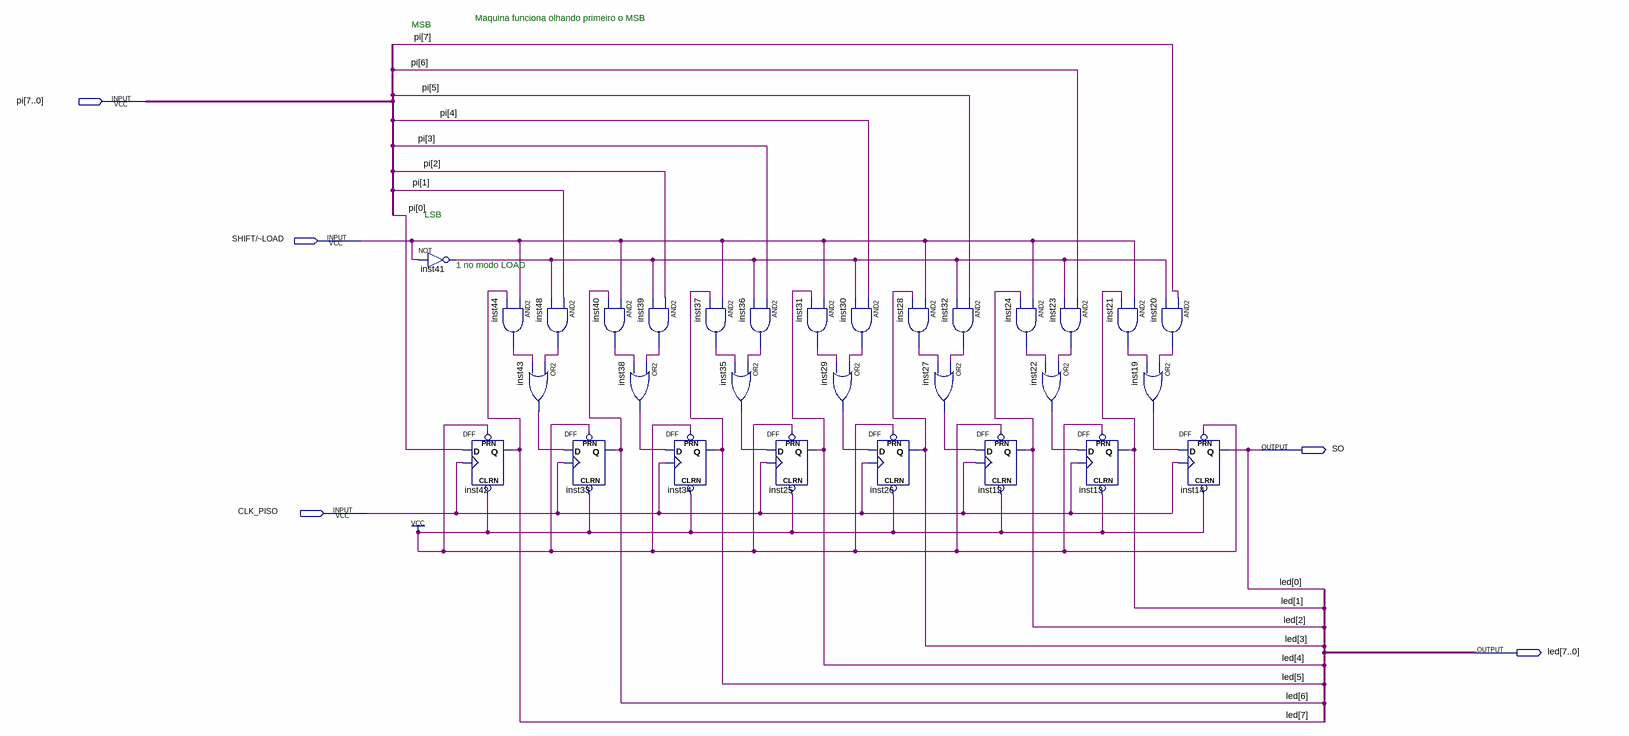
[diagram p0: schematic sheet]
// Quartus schematic piso.bdf as structural Verilog: 30 symbols, 5 pins
module piso (
  input  [7:0] pi,
  input  \SHIFT/~LOAD ,
  input  CLK_PISO,
  output SO,
  output [7:0] led
);

  wire inst19_out, inst20_out, inst21_out, inst22_out, inst23_out, inst24_out, inst27_out, inst28_out,
       inst29_out, inst30_out, inst31_out, inst32_out, inst35_out, inst36_out, inst37_out, inst38_out,
       inst39_out, inst40_out, inst41_out, inst43_out, inst44_out, inst48_out;

  not inst41 (inst41_out, \SHIFT/~LOAD );
  DFF inst42 (.CLRN(1'b1), .CLK(CLK_PISO), .D(pi[0]), .PRN(1'b1), .Q(led[7]));
  and inst44 (inst44_out, \SHIFT/~LOAD , led[7]);
  or inst43 (inst43_out, inst48_out, inst44_out);
  and inst48 (inst48_out, pi[1], inst41_out);
  DFF inst33 (.CLRN(1'b1), .CLK(CLK_PISO), .D(inst43_out), .PRN(1'b1), .Q(led[6]));
  and inst40 (inst40_out, \SHIFT/~LOAD , led[6]);
  or inst38 (inst38_out, inst39_out, inst40_out);
  and inst39 (inst39_out, pi[2], inst41_out);
  DFF inst34 (.CLRN(1'b1), .CLK(CLK_PISO), .D(inst38_out), .PRN(1'b1), .Q(led[5]));
  and inst37 (inst37_out, \SHIFT/~LOAD , led[5]);
  or inst35 (inst35_out, inst36_out, inst37_out);
  and inst36 (inst36_out, pi[3], inst41_out);
  DFF inst25 (.CLRN(1'b1), .CLK(CLK_PISO), .D(inst35_out), .PRN(1'b1), .Q(led[4]));
  and inst31 (inst31_out, \SHIFT/~LOAD , led[4]);
  or inst29 (inst29_out, inst30_out, inst31_out);
  and inst30 (inst30_out, pi[4], inst41_out);
  DFF inst26 (.CLRN(1'b1), .CLK(CLK_PISO), .D(inst29_out), .PRN(1'b1), .Q(led[3]));
  and inst28 (inst28_out, \SHIFT/~LOAD , led[3]);
  or inst27 (inst27_out, inst32_out, inst28_out);
  and inst32 (inst32_out, pi[5], inst41_out);
  DFF inst12 (.CLRN(1'b1), .CLK(CLK_PISO), .D(inst27_out), .PRN(1'b1), .Q(led[2]));
  and inst24 (inst24_out, \SHIFT/~LOAD , led[2]);
  and inst23 (inst23_out, pi[6], inst41_out);
  or inst22 (inst22_out, inst23_out, inst24_out);
  DFF inst13 (.CLRN(1'b1), .CLK(CLK_PISO), .D(inst22_out), .PRN(1'b1), .Q(led[1]));
  and inst21 (inst21_out, \SHIFT/~LOAD , led[1]);
  and inst20 (inst20_out, pi[7], inst41_out);
  or inst19 (inst19_out, inst20_out, inst21_out);
  DFF inst14 (.CLRN(1'b1), .CLK(CLK_PISO), .D(inst19_out), .PRN(1'b1), .Q(led[0]));

  assign SO = led[0];

  // Notes on the sheet:
  //   Maquina funciona olhando primeiro o MSB
  //   MSB
  //   LSB
  //   1 no modo LOAD
endmodule
